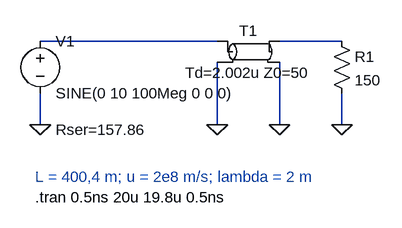
[diagram p0: schematic Q2c.asc]
Q2c.asc, the LTspice schematic file:
Version 4
SHEET 1 880 700
WIRE 144 128 -128 128
WIRE 336 128 240 128
WIRE -128 256 -128 208
WIRE 144 256 144 160
WIRE 240 256 240 160
WIRE 336 256 336 208
FLAG -128 256 0
FLAG 144 256 0
FLAG 240 256 0
FLAG 336 256 0
SYMBOL tline 192 144 R0
SYMATTR InstName T1
SYMATTR Value Td=2.002u Z0=50
SYMBOL res 320 112 R0
SYMATTR InstName R1
SYMATTR Value 150
SYMBOL voltage -128 112 R0
WINDOW 123 24 124 Left 2
WINDOW 39 24 152 Left 2
SYMATTR SpiceLine Rser=157.86
SYMATTR InstName V1
SYMATTR Value SINE(0 10 100Meg 0 0 0)
TEXT -136 336 Left 2 ;L = 400,4 m; u = 2e8 m/s; lambda = 2 m
TEXT -136 368 Left 2 !.tran 0.5ns 20u 19.8u 0.5ns

The netlist it stands for:
* Q2c.asc
T1 N001 0 N002 0 Td=2.002u Z0=50
R1 N002 0 150
V1 N001 0 SINE(0 10 100Meg 0 0 0) Rser=157.86
* L = 400,4 m; u = 2e8 m/s; lambda = 2 m
.tran 0.5ns 20u 19.8u 0.5ns
.backanno
.end